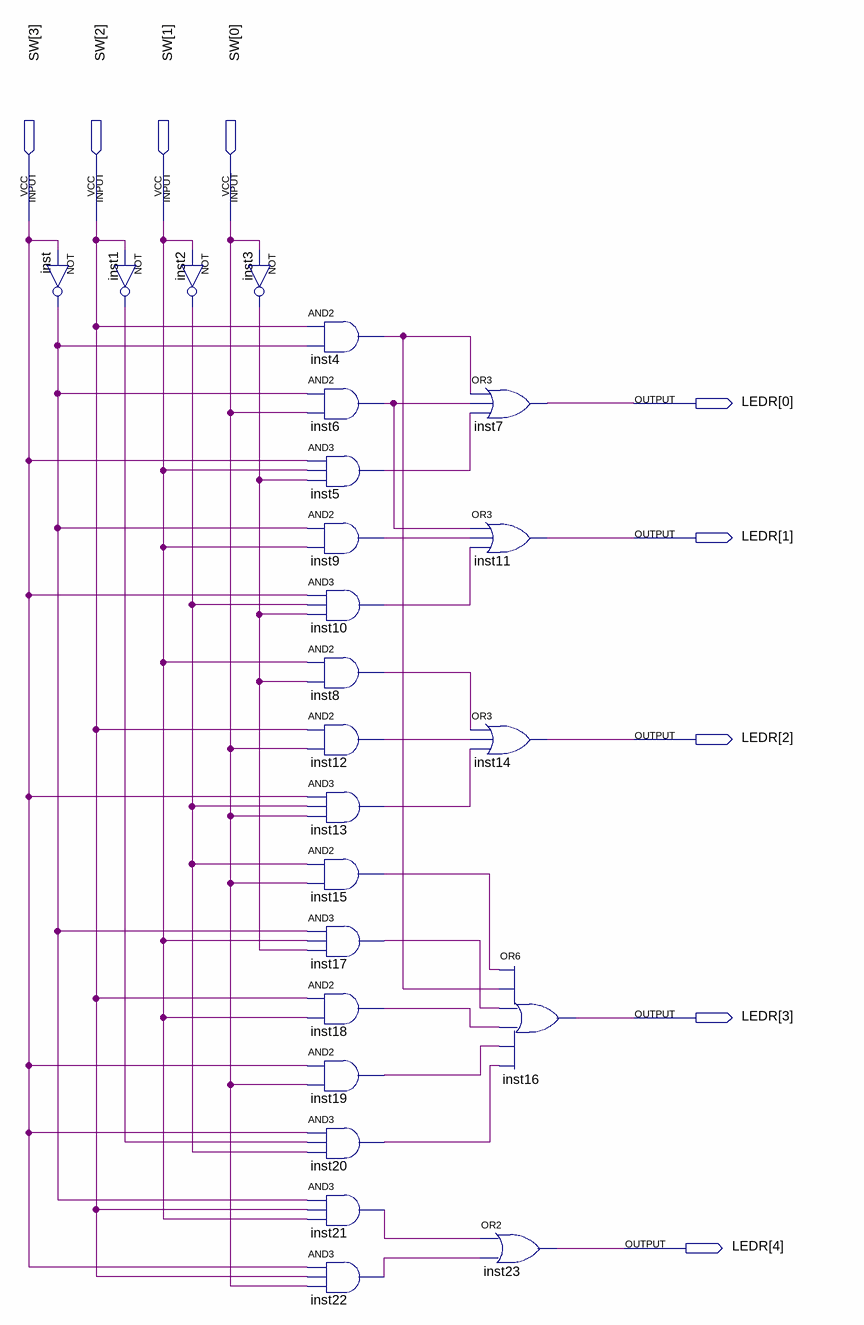
[diagram p0: schematic sheet]
// Quartus schematic transkoder.bdf as structural Verilog: 24 symbols, 9 pins
module transkoder (
  input  [3:0] SW,
  output [4:0] LEDR
);

  wire inst1_out, inst2_out, inst3_out, inst4_out, inst5_out, inst6_out, inst8_out, inst9_out, inst10_out,
       inst12_out, inst13_out, inst15_out, inst17_out, inst18_out, inst19_out, inst20_out, inst21_out,
       inst22_out, inst_out;

  not inst (inst_out, SW[3]);
  not inst1 (inst1_out, SW[2]);
  not inst2 (inst2_out, SW[1]);
  not inst3 (inst3_out, SW[0]);
  and inst4 (inst4_out, SW[2], inst_out);
  and inst6 (inst6_out, inst_out, SW[0]);
  and inst5 (inst5_out, SW[3], SW[1], inst3_out);
  and inst9 (inst9_out, inst_out, SW[1]);
  and inst10 (inst10_out, SW[3], inst2_out, inst3_out);
  and inst8 (inst8_out, SW[1], inst3_out);
  and inst12 (inst12_out, SW[2], SW[0]);
  and inst13 (inst13_out, SW[3], inst2_out, SW[0]);
  and inst15 (inst15_out, inst2_out, SW[0]);
  and inst17 (inst17_out, inst_out, SW[1], inst3_out);
  and inst18 (inst18_out, SW[2], SW[1]);
  and inst19 (inst19_out, SW[3], SW[0]);
  and inst20 (inst20_out, SW[3], inst1_out, inst2_out);
  and inst21 (inst21_out, inst_out, SW[2], SW[1]);
  and inst22 (inst22_out, SW[3], SW[2], SW[0]);
  or inst7 (LEDR[0], inst4_out, inst6_out, inst5_out);
  or inst11 (LEDR[1], inst6_out, inst9_out, inst10_out);
  or inst14 (LEDR[2], inst8_out, inst12_out, inst13_out);
  or inst16 (LEDR[3], inst15_out, inst4_out, inst17_out, inst18_out, inst19_out, inst20_out);
  or inst23 (LEDR[4], inst21_out, inst22_out);
endmodule
